# Altium schematic sheet Part14_SPI_ST7789.SchDoc
size A4
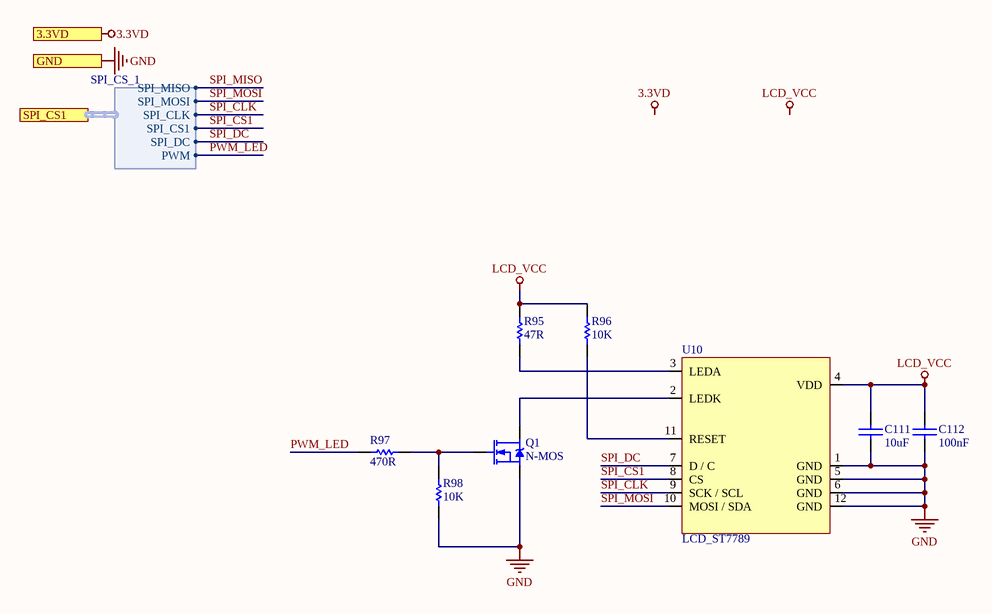
[diagram p0: Part14_SPI_ST7789.SchDoc]

## Parts
C111  10uF  [0603C]
C112  100nF  [0603C]
Q1  N-MOS  [SOT23]
R95  47R  [0603R]
R96  10K  [0603R]
R97  470R  [0603R]
R98  10K  [0603R]
U10  LCD_ST7789  [ST7789_1.3inch_IPS_TFT]

## Ports
3.3VD, GND, SPI_CS1 (harness SPI_CS_1)

## Harnesses
SPI_CS_1: SPI_MISO, SPI_MOSI, SPI_CLK, SPI_CS1, SPI_DC, PWM

## Nets
3.3VD: port 3.3VD
GND: C111.1 C112.1 Q1.S R98.1 U10.1(GND) U10.5(GND) U10.6(GND) U10.12(GND) ; port GND
LCD_VCC: C111.2 C112.2 R95.2 R96.2 U10.4(VDD)
PWM_LED: R97.1 ; port SPI_CS1.PWM
SPI_CLK: U10.9(SCK_/_SCL) ; port SPI_CS1.SPI_CLK
SPI_CS1: U10.8(CS) ; port SPI_CS1.SPI_CS1
SPI_DC: U10.7(D_/_C) ; port SPI_CS1.SPI_DC
SPI_MISO: port SPI_CS1.SPI_MISO
SPI_MOSI: U10.10(MOSI_/_SDA) ; port SPI_CS1.SPI_MOSI
NetQ1_D: Q1.D U10.2(LEDK)
NetQ1_G: Q1.G R97.2 R98.2
NetR95_1: R95.1 U10.3(LEDA)
NetR96_1: R96.1 U10.11(RESET)

## Notes on the sheet
- Labels drawn without touching a wire or pin: 3.3VD, LCD_VCC

## Library data of the parts
C111 C112 = CAP: 无极性电容
Q1 = N-MOS: N沟道场效应管
R95-R98 = RES